# EAGLE board pandaLight (EAGLE 7.6.0)
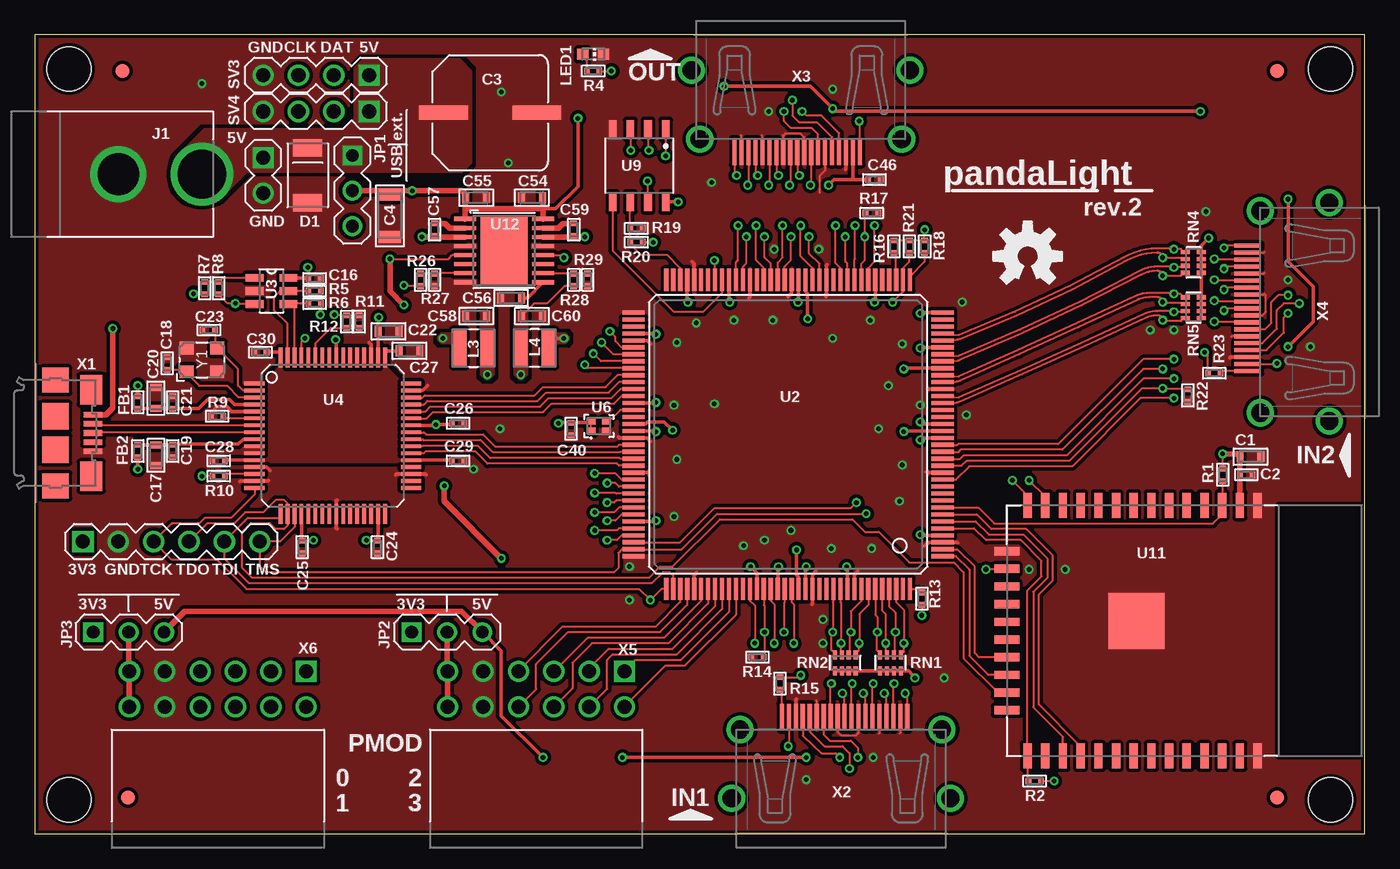
[diagram p9: board, top side]
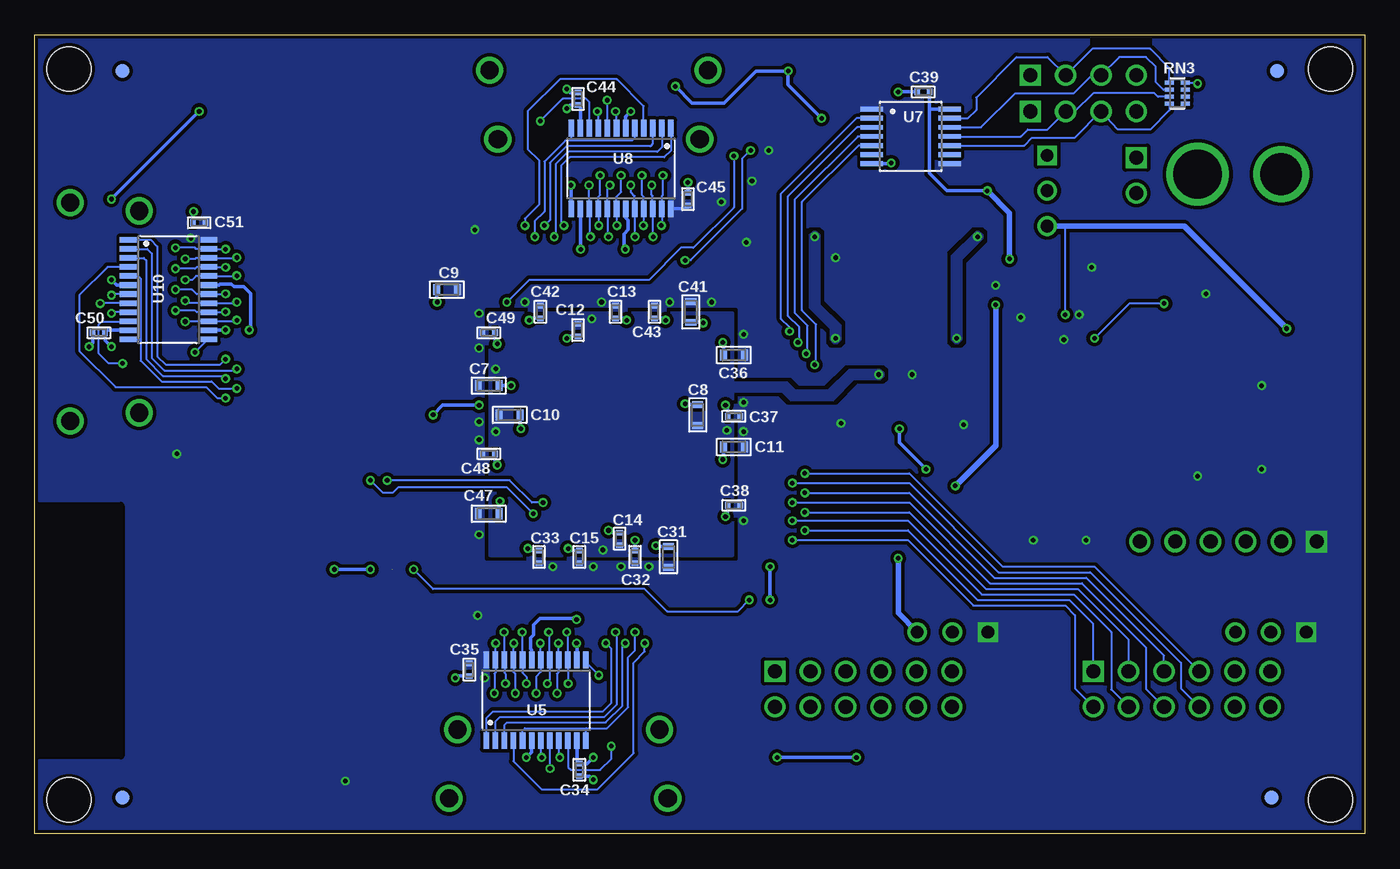
[diagram p10: board, bottom side, seen from below]

Size 95.5 x 57.4 mm. Coordinates in mm from the lower left corner, seen from the top.
Outline: 0,0 95.5,0 95.5,57.4 0,57.4 0,0
Copper layers (1*16): Top 0.035mm / dielectric 1.5mm / Bottom 0.035mm
Design rules "SeeedStudio_2layer_DRU_no_angle_20140221": minimum track width 6mil, minimum drill 12mil, track to track 6mil, track to pad 6mil, pad to pad 6mil, via to via 6mil, smd to smd 0mil, copper to edge 10mil, drill to drill 10mil, minimum pad ring 10mil, minimum via ring 6mil, stop-mask expansion 2mil, vias tented up to drill 100mil, thermal gap 10mil
Net classes: 0 default: width 0.152 mm, clearance 0.152 mm; 1 power: width 0.152 mm, clearance 0.152 mm; 2 tmds: width 0.152 mm, clearance 0.152 mm
Holes 3.17 mm at 2.45,54.95 2.45,2.45 93.05,54.95 93.05,2.45
tRestrict: 1 lines
bRestrict: 1 lines

## Footprints (pad centres in the part's own frame; a part is rotated, then mirrored left to right if it is on the bottom)
C0603 = smd 0.5 x 0.8: 1 -0.75,0; 2 0.75,0
C0402 = smd 0.4 x 0.5: 1 -0.45,0; 2 0.45,0
MVY_HA0 = smd 1 x 3.5: 1 0,3.35; 2 0,-3.35
C1206 = smd 0.85 x 1.6: 1 -1.525,0; 2 1.525,0
DO-214AC = smd 1.27 x 2.1: A 1.98,0; C -1.98,0
FB0402 = smd 0.4 x 0.5: 1 -0.45,0; 2 0.45,0
FIDUCIAL-1X2 = smd 1 x 1: 1 0,0
PJ-037A = drill 3: BARREL 0,0 | drill 3.5: CENTER 6,0
JP2 = drill 0.914 square: 1 -2.54,0 | drill 0.914: 2 0,0; 3 2.54,0
SRN3015_3X3 = smd 2.7 x 1: 1 0,1; 2 0,-1
LED-0603 = smd 0.8 x 0.8: A -0.75,0; C 0.75,0
R0402 = smd 0.4 x 0.5: 1 -0.45,0; 2 0.45,0
741C083 = smd 0.3 x 0.65: 1 -0.75,-0.575; 2 -0.25,-0.575; 3 0.25,-0.575; 4 0.75,-0.575; 5 0.75,0.575; 6 0.25,0.575; 7 -0.25,0.575; 8 -0.75,0.575
MA02-1 = drill 1.016 square: 1 -1.27,0 | drill 1.016: 2 1.27,0
MA06-1 = drill 1.016 square: 1 -6.35,0 | drill 1.016: 2 -3.81,0; 3 -1.27,0; 4 1.27,0; 5 3.81,0; 6 6.35,0
MA04-1 = drill 1.016 square: 1 -3.81,0 | drill 1.016: 2 -1.27,0; 3 1.27,0; 4 3.81,0
TQ144 = smd 1.6 x 0.3: P1 -11.1,8.75; P2 -11.1,8.25; P3 -11.1,7.75; P4 -11.1,7.25; P5 -11.1,6.75; P6 -11.1,6.25; P7 -11.1,5.75; P8 -11.1,5.25; P9 -11.1,4.75; P10 -11.1,4.25; P11 -11.1,3.75; P12 -11.1,3.25; P13 -11.1,2.75; P14 -11.1,2.25; P15 -11.1,1.75; P16 -11.1,1.25; P17 -11.1,0.75; P18 -11.1,0.25; P19 -11.1,-0.25; P20 -11.1,-0.75; P21 -11.1,-1.25; P22 -11.1,-1.75; P23 -11.1,-2.25; P24 -11.1,-2.75; P25 -11.1,-3.25; P26 -11.1,-3.75; P27 -11.1,-4.25; P28 -11.1,-4.75; P29 -11.1,-5.25; P30 -11.1,-5.75; P31 -11.1,-6.25; P32 -11.1,-6.75; P33 -11.1,-7.25; P34 -11.1,-7.75; P35 -11.1,-8.25; P36 -11.1,-8.75; P73 11.1,-8.75; P74 11.1,-8.25; P75 11.1,-7.75; P76 11.1,-7.25; P77 11.1,-6.75; P78 11.1,-6.25; P79 11.1,-5.75; P80 11.1,-5.25; P81 11.1,-4.75; P82 11.1,-4.25; P83 11.1,-3.75; P84 11.1,-3.25; P85 11.1,-2.75; P86 11.1,-2.25; P87 11.1,-1.75; P88 11.1,-1.25; P89 11.1,-0.75; P90 11.1,-0.25; P91 11.1,0.25; P92 11.1,0.75; P93 11.1,1.25; P94 11.1,1.75; P95 11.1,2.25; P96 11.1,2.75; P97 11.1,3.25; P98 11.1,3.75; P99 11.1,4.25; P100 11.1,4.75; P101 11.1,5.25; P102 11.1,5.75; P103 11.1,6.25; P104 11.1,6.75; P105 11.1,7.25; P106 11.1,7.75; P107 11.1,8.25; P108 11.1,8.75 | smd 0.3 x 1.6: P37 -8.75,-11.1; P38 -8.25,-11.1; P39 -7.75,-11.1; P40 -7.25,-11.1; P41 -6.75,-11.1; P42 -6.25,-11.1; P43 -5.75,-11.1; P44 -5.25,-11.1; P45 -4.75,-11.1; P46 -4.25,-11.1; P47 -3.75,-11.1; P48 -3.25,-11.1; P49 -2.75,-11.1; P50 -2.25,-11.1; P51 -1.75,-11.1; P52 -1.25,-11.1; P53 -0.75,-11.1; P54 -0.25,-11.1; P55 0.25,-11.1; P56 0.75,-11.1; P57 1.25,-11.1; P58 1.75,-11.1; P59 2.25,-11.1; P60 2.75,-11.1; P61 3.25,-11.1; P62 3.75,-11.1; P63 4.25,-11.1; P64 4.75,-11.1; P65 5.25,-11.1; P66 5.75,-11.1; P67 6.25,-11.1; P68 6.75,-11.1; P69 7.25,-11.1; P70 7.75,-11.1; P71 8.25,-11.1; P72 8.75,-11.1; P109 8.75,11.1; P110 8.25,11.1; P111 7.75,11.1; P112 7.25,11.1; P113 6.75,11.1; P114 6.25,11.1; P115 5.75,11.1; P116 5.25,11.1; P117 4.75,11.1; P118 4.25,11.1; P119 3.75,11.1; P120 3.25,11.1; P121 2.75,11.1; P122 2.25,11.1; P123 1.75,11.1; P124 1.25,11.1; P125 0.75,11.1; P126 0.25,11.1; P127 -0.25,11.1; P128 -0.75,11.1; P129 -1.25,11.1; P130 -1.75,11.1; P131 -2.25,11.1; P132 -2.75,11.1; P133 -3.25,11.1; P134 -3.75,11.1; P135 -4.25,11.1; P136 -4.75,11.1; P137 -5.25,11.1; P138 -5.75,11.1; P139 -6.25,11.1; P140 -6.75,11.1; P141 -7.25,11.1; P142 -7.75,11.1; P143 -8.25,11.1; P144 -8.75,11.1
SOT23-6 = smd 1.27 x 0.559: 1 -1.219,0.94; 2 -1.219,0; 3 -1.219,-0.94; 4 1.219,-0.94; 5 1.219,0; 6 1.219,0.94
LQFP64 = smd 1.45 x 0.27: 1 -5.625,3.75; 2 -5.625,3.25; 3 -5.625,2.75; 4 -5.625,2.25; 5 -5.625,1.75; 6 -5.625,1.25; 7 -5.625,0.75; 8 -5.625,0.25; 9 -5.625,-0.25; 10 -5.625,-0.75; 11 -5.625,-1.25; 12 -5.625,-1.75; 13 -5.625,-2.25; 14 -5.625,-2.75; 15 -5.625,-3.25; 16 -5.625,-3.75; 33 5.625,-3.75; 34 5.625,-3.25; 35 5.625,-2.75; 36 5.625,-2.25; 37 5.625,-1.75; 38 5.625,-1.25; 39 5.625,-0.75; 40 5.625,-0.25; 41 5.625,0.25; 42 5.625,0.75; 43 5.625,1.25; 44 5.625,1.75; 45 5.625,2.25; 46 5.625,2.75; 47 5.625,3.25; 48 5.625,3.75 | smd 0.27 x 1.45: 17 -3.75,-5.625; 18 -3.25,-5.625; 19 -2.75,-5.625; 20 -2.25,-5.625; 21 -1.75,-5.625; 22 -1.25,-5.625; 23 -0.75,-5.625; 24 -0.25,-5.625; 25 0.25,-5.625; 26 0.75,-5.625; 27 1.25,-5.625; 28 1.75,-5.625; 29 2.25,-5.625; 30 2.75,-5.625; 31 3.25,-5.625; 32 3.75,-5.625; 49 3.75,5.625; 50 3.25,5.625; 51 2.75,5.625; 52 2.25,5.625; 53 1.75,5.625; 54 1.25,5.625; 55 0.75,5.625; 56 0.25,5.625; 57 -0.25,5.625; 58 -0.75,5.625; 59 -1.25,5.625; 60 -1.75,5.625; 61 -2.25,5.625; 62 -2.75,5.625; 63 -3.25,5.625; 64 -3.75,5.625
PW_R-PDSO-G24 = smd 1.2 x 0.4: 1 -2.9,3.575; 2 -2.9,2.925; 3 -2.9,2.275; 4 -2.9,1.625; 5 -2.9,0.975; 6 -2.9,0.325; 7 -2.9,-0.325; 8 -2.9,-0.975; 9 -2.9,-1.625; 10 -2.9,-2.275; 11 -2.9,-2.925; 12 -2.9,-3.575; 13 2.9,-3.575; 14 2.9,-2.925; 15 2.9,-2.275; 16 2.9,-1.625; 17 2.9,-0.975; 18 2.9,-0.325; 19 2.9,0.325; 20 2.9,0.975; 21 2.9,1.625; 22 2.9,2.275; 23 2.9,2.925; 24 2.9,3.575
OSCI-1.6X1.2 = smd 0.6 x 0.5: 1 -0.55,-0.35; 2 0.55,-0.35; 3 0.55,0.35; 4 -0.55,0.35
R-PDSO-G14 = smd 0.35 x 1.6: 1 -1.95,-2.8; 2 -1.3,-2.8; 3 -0.65,-2.8; 4 0,-2.8; 5 0.65,-2.8; 6 1.3,-2.8; 7 1.95,-2.8; 8 1.95,2.8; 9 1.3,2.8; 10 0.65,2.8; 11 0,2.8; 12 -0.65,2.8; 13 -1.3,2.8; 14 -1.95,2.8
SO8N = smd 1.35 x 0.55: 1 -2.6,1.905; 2 -2.6,0.635; 3 -2.6,-0.635; 4 -2.6,-1.905; 5 2.6,-1.905; 6 2.6,-0.635; 7 2.6,0.635; 8 2.6,1.905
ESP-WROOM-32 = smd 1.8 x 0.6: 1 -8.3,8.7; 2 -8.3,7.43; 3 -8.3,6.16; 4 -8.3,4.89; 5 -8.3,3.62; 6 -8.3,2.35; 7 -8.3,1.08; 8 -8.3,-0.19; 9 -8.3,-1.46; 10 -8.3,-2.73; 11 -8.3,-4; 12 -8.3,-5.27; 13 -8.3,-6.54; 14 -8.3,-7.81; 25 9.7,-7.81; 26 9.7,-6.54; 27 9.7,-5.27; 28 9.7,-4; 29 9.7,-2.73; 30 9.7,-1.46; 31 9.7,-0.19; 32 9.7,1.08; 33 9.7,2.35; 34 9.7,3.62; 35 9.7,4.89; 36 9.7,6.16; 37 9.7,7.43; 38 9.7,8.7 | smd 0.6 x 1.8: 15 -5.015,-9.3; 16 -3.745,-9.3; 17 -2.475,-9.3; 18 -1.205,-9.3; 19 0.065,-9.3; 20 1.335,-9.3; 21 2.605,-9.3; 22 3.875,-9.3; 23 5.145,-9.3; 24 6.415,-9.3 | smd 4 x 4: PAD 0,0
R-PDSO-G16 = smd 0.3 x 1.6: 1 -2.275,-2.8; 2 -1.625,-2.8; 3 -0.975,-2.8; 4 -0.325,-2.8; 5 0.325,-2.8; 6 0.975,-2.8; 7 1.625,-2.8; 8 2.275,-2.8; 9 2.275,2.8; 10 1.625,2.8; 11 0.975,2.8; 12 0.325,2.8; 13 -0.325,2.8; 14 -0.975,2.8; 15 -1.625,2.8; 16 -2.275,2.8 | smd 5 x 3.4: ETP 0,0
USB-UB-S = smd 0.4 x 1.35: D+ 0,2.675; D- -0.65,2.675; GND 1.3,2.675; ID 0.65,2.675; VBUS -1.3,2.675 | smd 1.8 x 1.9: SH0 -3.8,0; SH3 3.8,0 | smd 1.9 x 1.9: SH1 -1.2,0; SH2 1.2,0 | smd 2.1 x 1.6: SH4 3.1,2.55; SH5 -3.1,2.55
HDMI_TYPE_A_RECEPTICAL = smd 1.9 x 0.3: 1 -3.9,4.75; 2 -3.9,4.25; 3 -3.9,3.75; 4 -3.9,3.25; 5 -3.9,2.75; 6 -3.9,2.25; 7 -3.9,1.75; 8 -3.9,1.25; 9 -3.9,0.75; 10 -3.9,0.25; 11 -3.9,-0.25; 12 -3.9,-0.75; 13 -3.9,-1.25; 14 -3.9,-1.75; 15 -3.9,-2.25; 16 -3.9,-2.75; 17 -3.9,-3.25; 18 -3.9,-3.75; 19 -3.9,-4.25 | drill 1.3: SHIELD0 -3,7.25; SHIELD1 1.95,7.85; SHIELD2 -3,-7.25; SHIELD3 1.95,-7.85
PMOD-2X6 = drill 1.016 square: 1 6.35,1.27 | drill 1.016: 2 3.81,1.27; 3 1.27,1.27; 4 -1.27,1.27; 5 -3.81,1.27; 6 -6.35,1.27; 7 6.35,-1.27; 8 3.81,-1.27; 9 1.27,-1.27; 10 -1.27,-1.27; 11 -3.81,-1.27; 12 -6.35,-1.27
403-3.2X2.5 = smd 1 x 0.9: 1 -1.1,-0.8; 2 1.1,-0.8; 3 1.1,0.9; 4 -1.1,0.9

## Placement (x,y rotation side)
C1  10u  [C0603]  87.3,27.1 0 top
C2  0.1u  [C0402]  87,25.8 0 top
C3  1000u  [MVY_HA0]  32.7,51.8 90 top
C4  100u  [C1206]  25.5,44.4 270 top
C7  4.7u  [C0603]  62.9,32.2 0 bottom
C8  4.7u  [C0603]  47.9,30.1 90 bottom
C9  4.7u  [C0603]  65.9,39.1 180 bottom
C10  4.7u  [C0603]  61.4,30.1 0 bottom
C11  4.7u  [C0603]  45.3,27.8 180 bottom
C12  0.47u  [C0402]  56.5,36.2 270 bottom
C13  0.47u  [C0402]  53.8,37.5 270 bottom
C14  0.47u  [C0402]  53.5,21.2 90 bottom
C15  0.47u  [C0402]  56.4,19.9 90 bottom
C16  0.1u  [C0402]  20.1,39.9 0 top
C17  4.7u  [C0603]  8.7,27.2 270 top
C18  27p  [C0402]  9.5,33.8 90 top
C19  0.1u  [C0402]  9.9,27.5 270 top
C20  4.7u  [C0603]  8.7,31.3 90 top
C21  0.1u  [C0402]  9.9,31 90 top
C22  4.7u  [C0603]  25.4,36.1 0 top
C23  27p  [C0402]  12.5,36.2 180 top
C24  0.1u  [C0402]  24.6,20.6 270 top
C25  0.1u  [C0402]  19.2,20.6 270 top
C26  0.1u  [C0402]  30.4,29.5 0 top
C27  4.7u  [C0603]  26.9,34.7 0 top
C28  0.1u  [C0402]  13.2,26.8 180 top
C29  0.1u  [C0402]  30.4,26.8 0 top
C30  0.1u  [C0402]  16.2,34.6 180 top
C31  4.7u  [C0603]  50,19.9 90 bottom
C32  0.47u  [C0402]  52.4,19.9 90 bottom
C33  0.47u  [C0402]  59.3,19.9 90 bottom
C34  0.1u  [C0402]  56.4,4.6 270 bottom
C35  0.1u  [C0402]  64.3,11.8 270 bottom
C36  4.7u  [C0603]  45.3,34.4 180 bottom
C37  0.47u  [C0402]  45.3,30 180 bottom
C38  0.47u  [C0402]  45.3,23.6 180 bottom
C39  0.47u  [C0402]  31.7,53.3 180 bottom
C40  0.1u  [C0402]  38.5,29.1 270 top
C41  4.7u  [C0603]  48.4,37.5 270 bottom
C42  0.47u  [C0402]  59.2,37.5 270 bottom
C43  0.47u  [C0402]  51,37.5 270 bottom
C44  0.1u  [C0402]  56.5,52.8 90 bottom
C45  0.1u  [C0402]  48.6,45.6 90 bottom
C46  0.1u  [C0402]  60.3,47 0 top
C47  4.7u  [C0603]  62.9,23 0 bottom
C48  0.47u  [C0402]  62.9,27.3 0 bottom
C49  0.47u  [C0402]  62.9,36 0 bottom
C50  0.1u  [C0402]  90.9,36 180 bottom
C51  0.1u  [C0402]  83.7,43.9 180 bottom
C54  10u  [C0603]  35.7,45.7 180 top
C55  10u  [C0603]  31.7,45.7 0 top
C56  4.7u  [C0603]  34.2,38.5 180 top
C57  0.1u  [C0402]  28.7,43.4 270 top
C58  22u  [C0603]  31.7,37.2 180 top
C59  0.1u  [C0402]  38.7,43.4 270 top
C60  22u  [C0603]  35.7,37.2 0 top
D1  6V  [DO-214AC]  19.6,47.3 270 top
FB1  1A  [FB0402]  7.4,31 270 top
FB2  1A  [FB0402]  7.4,27.5 90 top
FID1  FIDUCIAL1X2  [FIDUCIAL-1X2]  6.3,54.8 0 top
FID2  FIDUCIAL1X2  [FIDUCIAL-1X2]  89.2,54.8 0 top
FID3  FIDUCIAL1X2  [FIDUCIAL-1X2]  6.7,2.6 0 top
FID4  FIDUCIAL1X2  [FIDUCIAL-1X2]  89.2,2.6 0 top
FID5  FIDUCIAL1X2  [FIDUCIAL-1X2]  6.3,54.8 0 bottom
FID6  FIDUCIAL1X2  [FIDUCIAL-1X2]  89.2,54.8 0 bottom
FID7  FIDUCIAL1X2  [FIDUCIAL-1X2]  6.7,2.6 0 bottom
FID8  FIDUCIAL1X2  [FIDUCIAL-1X2]  89.2,2.6 0 bottom
J1  PJ-037A  [PJ-037A]  6,47.4 0 top
JP1  5V_SEL  [JP2]  22.8,46.2 270 top
JP2  PMOD2-3_VCC_SEL  [JP2]  29.6,14.5 0 top
JP3  PMOD0-1_VCC_SEL  [JP2]  6.74,14.5 0 top
L3  2.2u, 1.3A  [SRN3015_3X3]  31.5,34.9 90 top
L4  1.5u, 1.3  [SRN3015_3X3]  35.9,34.9 270 top
LED1  Green  [LED-0603]  40.1,56 0 top
OSHW-LOGO  [OSHW-LOGO-M]  71.3,41.5 0 top
R1  10k  [R0402]  85.3,25.8 90 top
R2  4.7k  [R0402]  71.8,3.8 0 top
R4  1k  [R0402]  40.1,54.8 0 top
R5  10k  [R0402]  20.1,39 0 top
R6  10k  [R0402]  20.1,38.1 0 top
R7  10k  [R0402]  12.2,39.2 270 top
R8  2.2k  [R0402]  13.2,39.2 270 top
R9  12k  [R0402]  13.1,30 0 top
R10  10k  [R0402]  13.2,25.7 0 top
R11  10k  [R0402]  23.3,36.8 90 top
R12  4.7k  [R0402]  22.4,36.8 270 top
R13  1k  [R0402]  63.7,16.9 270 top
R14  10k  [R0402]  51.9,12.7 0 top
R15  1k  [R0402]  53.5,10.8 270 top
R16  4.7k  [R0402]  61.7,42.2 90 top
R17  10k  [R0402]  60.1,44.6 180 top
R18  4.7k  [R0402]  63.9,42.2 90 top
R19  100  [R0402]  43.2,43.5 180 top
R20  100  [R0402]  43.2,42.5 0 top
R21  2.4k  [R0402]  62.8,42.2 90 top
R22  10k  [R0402]  82.8,31.5 90 top
R23  1k  [R0402]  84.7,33.1 0 top
R26  73.2  [R0402]  27.7,39.8 270 top
R27  22.1  [R0402]  28.7,39.8 270 top
R28  12.7  [R0402]  38.7,39.8 270 top
R29  22.1  [R0402]  39.7,39.8 270 top
RN1  51  [741C083]  61.45,12.3 180 top
RN2  51  [741C083]  58.2,12.3 180 top
RN3  100k  [741C083]  13.44,53.2 90 bottom
RN4  51  [741C083]  83.2,41.05 270 top
RN5  51  [741C083]  83.2,37.8 270 top
SV1  EXT_SUP  [MA02-1]  16.4,47.3 270 top
SV2  JTAG  [MA06-1]  9.8,21 0 top
SV3  LEDS_CON  [MA04-1]  20.2,54.5 180 top
SV4  LEDS_CON  [MA04-1]  20.2,51.9 180 top
U2  6SLX9TQG144  [TQ144]  54.1,28.7 180 top
U3  93LC46BT-I/OT  [SOT23-6]  17,39 0 top
U4  FT2232HL  [LQFP64]  21.4,28.6 0 top
U5  TPD12S016PWR  [PW_R-PDSO-G24]  59.5,9.6 90 bottom
U6  20Mhz  [OSCI-1.6X1.2]  40.5,29.3 0 top
U7  TXB0104PWR  [R-PDSO-G14]  32.6,50.1 270 bottom
U8  TPD12S016PWR  [PW_R-PDSO-G24]  53.4,47.8 270 bottom
U9  M25P40-VMN  [SO8N]  43.4,48 270 top
U10  TPD12S016PWR  [PW_R-PDSO-G24]  85.9,39.1 0 bottom
U11  ESP-WROOM-32  [ESP-WROOM-32]  79.1,15.3 270 top
U12  TPS542941PWP  [R-PDSO-G16]  33.7,41.9 270 top
X1  USBUB-S  [USB-UB-S]  1.5,28.8 270 top
X2  HDMI_RECEPTICAL_A  [HDMI_TYPE_A_RECEPTICAL]  57.9,4.5 270 top
X3  HDMI_RECEPTICAL_A  [HDMI_TYPE_A_RECEPTICAL]  55,52.9 90 top
X4  HDMI_RECEPTICAL_A  [HDMI_TYPE_A_RECEPTICAL]  91,37.5 0 top
X5  PMOD-2X6  [PMOD-2X6]  36,10.4 0 top
X6  PMOD-2X6  [PMOD-2X6]  13.14,10.4 0 top
Y1  403  [403-3.2X2.5]  12,34 0 top

## Tracks (layer width: path | path; a pad name or v marks a point on that pad's centre or on a via)
5V_SUP
  pour Top (isolate 0.254, no thermals): 31.3,54.8 31.3,48.2 30.7,47.6 15.2,47.6 13.6,46 arc-180 10.4,48.8 12.2,50.6 22.3,50.6 23,51.3 23,55 23.6,55.6 30.5,55.6
+1V2  (via drill 0.33)
  Top 0.152: R28.2 38.05,39.35 36.8,38.1 35.85,38.1 C60.1
  Top 0.254: U2.P28 62.45,33.45 v62.4,33.4 | U2.P19 62.45,28.95 v62.4,28.9 | U2.P52 55.35,38.95 55.5,38.8 v55.5,37 | U2.P128 54.85,18.45 54.7,18.6 v54.7,20.4 | U2.P89 43.85,29.45 44,29.6 45.2,29.6 v45.8,29
  other vias: 34.9,33
  pour Bottom (isolate 0.254, no thermals): 45.4,37.4 62.8,37.4 62.8,20 45.4,20 45.4,31.8 41.8,31.8 41.2,31.2 38.2,31.2 36.7,32.7 34.8,32.7 34.6,32.9 34.6,33.1 34.8,33.3 37,33.3 38.5,31.8 40.9,31.8 41.5,32.4 45.4,32.4
  pour Top (isolate 0.254, no thermals): 35.3,37.5 35.3,33 35,32.7 34.8,32.7 34.5,33 34.5,37.5
+1V8
  Top 0.254: U4.37 29.9,26.85 C29.1 | U4.12 13.7,26.85 C28.1 | U4.64 17.65,34.6 C30.1 | U4.49 25.15,34.65 25.2,34.7 C27.1
  pour Top (isolate 0.254, no thermals): 16.5,32.5 16.5,26.7 26.3,26.7 26.3,32.5 25.3,33.5 17.5,33.5
+3V3  (via drill 0.33)
  Top 0.152: R13.2 v63.7,15.7 | U9.3 42.77,49.13 v42.8,49.1 | R20.2 v44.4,42.5 | v63.9,43.4 R18.2 R21.2 R16.2 | U6.1 U6.4 | R7.2 11.45,38.75 v11.4,38.8 | R10.1 v12,25.7 | v44,46.9 44.03,46.87 U9.7 | R6.2 R5.2 20.55,37.35 v20.5,37.3 | R26.2 26.55,39.35 v26.5,39.4 | U12.12 37.83,41.58 v38,41.4 | R1.2 v85.3,27.3 | R2.2 v73.2,3.8
  Top 0.254: U2.P53 54.83,38.23 v54.8,38.2 | U4.56 21.65,35.45 v21.6,35.5 | U4.42 28.75,29.35 v28.8,29.4 29.85,29.4 C26.1 | U2.P76 44.55,35.95 v44.6,35.9 | U2.P42 60.35,38.25 v60.3,38.2 | U2.P36 63.65,37.45 v63.6,37.4 | U2.P4 63.65,21.45 v63.6,21.5 | U2.P135 58.35,19.15 v58.3,19.2 | U2.P125 53.35,19.15 v53.4,19.2 | U2.P122 51.85,18.75 v51.4,19.2 | U2.P31 63.65,34.95 v63.6,34.9 | U9.8 v46.2,45.4 | U2.P20 63.75,29.45 v63.6,29.6 | U2.P18 63.75,28.45 v63.6,28.3 | U2.P86 44.55,30.95 v44.6,31 | U2.P90 44.55,28.95 v44.6,28.9 | U2.P103 44.55,22.45 v44.6,22.5 | U2.P129 55.35,19.15 v55.4,19.2 | U2.P63 49.85,38.25 v49.9,38.2 | U2.P69 46.85,38.25 v46.9,38.2 | RN2.5 RN2.6 RN2.7 RN2.8 RN1.5 RN1.6 RN1.7 RN1.8 62.77,11.72 v63.2,11.2 | RN5.5 RN5.6 RN5.7 RN5.8 RN4.5 RN4.6 RN4.7 RN4.8 83.78,42.27 v84.3,42.8 | FB2.1 v7.4,26.2 | FB1.1 v7.4,32.2 | U4.20 19.15,21.1 C25.1 19.95,21.05 v20,21.1 | U4.31 24.65,21.1 C24.1 23.85,21.05 v23.8,21.1 | v37.6,29.5 37.65,29.55 C40.1 39.85,29.55 U6.4 | U4.50 C22.1 24.65,37.05 v24.7,37.1 | U3.6 19.61,39.94 C16.1 19.65,40.65 v19.6,40.7
  Top 0.406: v85.3,27.3 86.35,27.3 C1.1 C2.1 86.53,25.78 U11.2
  Bottom 0.254: U8.24 48.65,44.9 C45.1
  other vias: 32.5,33
  pour Bottom (isolate 0.254, rank 6, no thermals): 0,57.4 95.5,57.4 95.5,0 0,0
  pour Top (isolate 0.254, no thermals): 32.1,37.5 32.9,37.5 32.9,33 32.6,32.7 32.4,32.7 32.1,33
+5V  (via drill 0.33)
  Top 0.152: v25.5,41.3 29.7,41.3 29.98,41.58 U12.5 | R4.2 v41.4,54.8
  Top 0.254: v49.5,53.7 55.7,53.7 v57.3,52.1 57.5,51.9 v83.7,51.9 | v55.4,5.5 v42.2,5.5 | v36.5,5.5 33.5,8.5 33.5,13.14 JP2.3 | v90,45.6 90,41.1 91.8,39.3 91.8,36.8 v90,35 | 36.5,44.9 37.4,44.9 39,46.5 v39,51.4
  Top 0.406: v29.4,25 29.4,23.9 v33.5,19.8 | JP3.3 10.78,16 30.64,16 JP2.3 | JP1.2 25.3,46.2 | 25.3,46.2 v27.1,46.2 30.7,46.2 30.95,45.95 C55.1 30.9,45.65 30.9,44.9 | 36.5,44.9 30.9,44.9 | U12.1 30.9,44.9 | U12.16 36.5,44.9 | 36.5,44.9 36.5,45.65 C54.1 | C4.1 25.3,46.2 | v26.5,38 25.5,39 v25.5,41.3
  Bottom 0.254: U8.11 56.33,52.17 C44.1 57.05,52.35 v57.3,52.1 | v55.4,5.5 55.85,5.05 C34.1 56.58,5.22 U5.11 | v42.2,5.5 v36.5,5.5 | U10.11 90.28,36.17 C50.1 90.45,35.45 v90,35 | v49.5,53.7 48.3,52.5 46,52.5 43.7,54.8 v41.4,54.8 41.4,53.8 v39,51.4 | U7.14 31.25,52.05 | 31.25,52.05 C39.1 | 31.25,52.05 31.25,47.45 30,46.2 v27.1,46.2 | v90,45.6 v83.7,51.9
  Bottom 0.406: v25.5,41.3 25.5,44.6 v27.1,46.2 | v26.5,38 26.5,27.9 v29.4,25 | v33.5,19.8 33.5,15.86 JP2.3
ESP_CTS
  Top 0.152: U2.P1 66.15,19.95 67.1,19 67.1,12.8 68.47,11.43 U11.22
ESP_EN
  Top 0.152: R1.1 85.26,25.31 U11.3 85.26,22.96 84.6,22.3 68.9,22.3 67.75,23.45 U2.P8
ESP_IO0
  Top 0.152: R2.1 71.29,3.86 U11.25 71.29,17.49 72.3,18.5 72.3,19.6 70.8,21.1 68.3,21.1 67.45,21.95 U2.P5
ESP_RTS
  Top 0.152: U2.P2 66.25,20.45 67.5,19.2 67.5,13 67.81,12.7 U11.21
ESP_RX
  Top 0.152: U2.P6 67.55,22.45 68.5,21.5 71,21.5 72.7,19.8 72.7,18.4 71.7,17.4 71.7,9.1 73.83,6.97 U11.27
ESP_TDO
  Top 0.152: SV2.4 12.37,22.3 14.3,22.3 15.1,23.1 16.4,23.1 17.3,24 17.9,24 18.15,23.75 U4.18 18.15,22.15 17.9,21.9 17.3,21.9 16.9,22.3 15.5,22.3 14.9,21.7 14.9,19.1 15.6,18.4 44.1,18.4 44.9,19.2 45.8,19.2 49.2,22.6 58.7,22.6 59.6,21.7 60.6,21.7 62.8,19.5 66,19.5 66.7,18.8 66.7,12.6 69.14,10.15 U11.23
ESP_TX
  Top 0.152: U11.28 75.1,6.3 72.1,9.3 72.1,17.2 73.1,18.2 73.1,20 71.2,21.9 68.7,21.9 67.65,22.95 U2.P7
FPGA_CLK20
  Top 0.152: U2.P87 42.05,30.45 41.25,29.65 U6.3
FPGA_TDO  (via drill 0.33)
  Top 0.152: U2.P106 46.35,20.95 48.8,23.4 58.6,23.4 v59,23.8 | U11.14 71.29,24.31 v70.2,25.4
  Bottom 0.152: v59,23.8 59.8,23.8 61.4,25.4 v70.2,25.4
GND  (via drill 0.33)
  Top 0.152: X2.2 62.15,7.25 62.1,7.2 | X2.5 60.65,7.25 60.6,7.2 | X2.8 59.15,7.25 59,7.1 57.9,7.1 57.65,7.35 X2.11 | X2.14 56.15,9.55 56.1,9.6 | X4.2 88.25,41.75 88.3,41.8 | X4.5 88.25,40.25 88.3,40.3 | X4.8 88.25,38.75 88.3,38.8 88.4,38.7 88.4,37.5 88.15,37.25 X4.11 | X4.14 85.95,35.75 85.9,35.7 | X3.2 50.75,50.15 50.7,50.2 | X3.5 52.25,50.15 52.2,50.2 | X3.8 53.75,50.15 | 53.75,50.15 53.7,50.2 | X3.11 55.25,50.05 55,50.3 53.9,50.3 53.75,50.15 | X3.14 56.75,47.65 56.35,47.25 56.35,46.05
  Top 0.254: U4.51 24.15,35.15 24,35.3 | U4.47 27.85,31.85 28.2,32.2 | U2.P68 47.35,40.95 47.2,41.1 | U2.P60 51.35,38.55 51.3,38.5 | 56.8,38.6 56.85,38.65 U2.P49 56.85,40.85 56.9,40.9 | U2.P25 64.15,31.95 64.1,32 | 56.1,18.9 55.85,18.65 U2.P130 55.85,16.55 55.8,16.5 | U2.P136 58.85,18.65 59.1,18.9 | 66.3,20.9 66.25,20.95 U2.P3 64.15,20.95 63.9,20.7 | U2.P13 64.05,25.95 64,26 | U2.P113 47.35,18.65 47.5,18.8 | X2.17 54.65,9.65 54.7,9.7 | X4.17 85.85,34.25 85.8,34.2 | X3.17 58.25,47.75 58.2,47.7 | 21.7,24 21.65,23.95 U4.25 21.65,21.95 21.7,21.9 | 25.9,25.8 25.95,25.85 U4.35 28.05,25.85 28.1,25.8 | 41.9,28.5 41.95,28.45 U2.P91 43.95,28.45 44.2,28.2 | 16.8,25.4 16.75,25.35 U4.15 14.75,25.35 14.7,25.3 | U4.13 16.65,26.35 16.9,26.1 | U4.5 14.15,30.35 13.8,30.7 13.1,30.7 12.65,30.25 R9.1 | U2.P54 54.35,38.85 54.1,38.6 | U2.P96 44.05,25.95 44.1,26 | U2.P77 43.95,35.45 44.2,35.2
  Bottom 0.152: RN3.1 RN3.2 RN3.3 RN3.4 12.05,53.95 v12,53.9
  Bottom 0.254: U8.14 56.33,43.73 v56.3,42 | U8.6 53.08,51.52 v52.7,51.9 | U5.14 56.58,13.68 v56.6,13.7 | U5.6 59.83,5.88 v60.2,5.5 | v42.7,19.2 v42.7,16.8 | C7.2 v61.3,32.2 | C32.2 v52.4,21.1 | U5.19 59.83,13.22 59.9,13.3 59.9,14.1 59.7,14.3 59.7,15 59.2,15.5 56.7,15.5 v56.6,15.4 | U8.19 53.08,44.27 52.9,44.1 52.9,43.4 53.2,43.1 53.2,42.1 v53.1,42 | U10.14 81.83,36.17 v81.8,36.2 | U10.19 82.28,39.42 82.2,39.5 81.4,39.5 81.2,39.3 80.5,39.3 80,38.8 80,36.3 v80.1,36.2 | U10.6 89.62,39.42 v90,39.8 | 91.55,35.05 v91.6,35 91.35,35.25 C50.2 | 55.45,3.95 v55.4,3.9 55.65,4.15 C34.2 | C45.2 v48.6,46.8 | C44.2 57.05,53.25 v57.3,53.5 | C9.2 66.65,38.25 v66.6,38.2 | C51.2 84.15,44.65 v84.1,44.7 | C35.2 65.15,11.35 v65.3,11.2 | C33.2 59.95,20.35 v60.1,20.5 | C47.2 62.15,23.85 v62.1,23.9 | C48.2 62.45,26.65 v62.3,26.5 | C10.2 60.65,29.15 v60.6,29.1 | C15.2 57.05,20.35 v57.2,20.5 | C49.2 62.45,35.35 v62.3,35.2 | C42.2 59.85,37.05 v60,36.9 | C12.2 57.15,35.75 v57.3,35.6 | C14.2 54.15,21.65 v54.3,21.8 | C31.2 50.95,20.65 v50.9,20.7 | C38.2 45.75,22.95 v45.9,22.8 | C11.2 46.05,26.95 v46.1,26.9 | C37.2 45.75,30.65 v45.9,30.8 | C8.2 48.75,30.85 v48.8,30.9 | C36.2 46.05,35.25 v46.1,35.3 | C41.2 47.55,36.75 v47.5,36.7 | C43.2 50.35,37.05 v50.2,36.9 | C13.2 53.15,37.05 v53,36.9 | C39.2 v33.5,53.3 | U7.7 34.05,48.15 v34,48.2 | v33.4,29.1 33.4,28.1 v31.5,26.2 | v63.6,30.8 66.2,30.8 v66.9,30.1 | v71.4,19 v74,19
  pour Top (isolate 0.254, rank 6, no thermals): 0,57.4 95.5,57.4 95.5,0 0,0
HDMI_RX0_CEC  (via drill 0.33)
  Top 0.152: v59.1,5.5 59.1,6.2 58.6,6.7 57.1,6.7 56.65,7.15 X2.13
  Bottom 0.152: U5.7 59.17,5.58 v59.1,5.5
HDMI_RX0_CEC_3V3  (via drill 0.33)
  Top 0.152: U2.P127 54.35,16.65 54.5,16.5 v54.5,13.7
  Bottom 0.152: U5.1 63.08,8.32 62.6,8.8 54.7,8.8 54.1,9.4 54.1,13.3 v54.5,13.7
HDMI_RX0_CLK_N  (via drill 0.33)
  Top 0.152: RN2.4 57.45,12.97 57.23,13.2 57.23,14.43 v57.3,14.5 57.3,16.7 57.35,16.75 U2.P133 | X2.12 57.15,10.75 v57.2,10.8
  Bottom 0.152: v57.2,10.8 57.2,11.7 57.23,11.72 U5.15 57.23,14.43 v57.3,14.5
HDMI_RX0_CLK_P  (via drill 0.33)
  Top 0.152: 58.1,10 v58,10.1 58.15,9.95 X2.10 | RN2.3 57.95,13.03 57.88,13.1 57.88,13.68 v57.9,13.7 57.9,16.6 57.85,16.65 U2.P134
  Bottom 0.152: v58,10.1 58,11.5 57.88,11.62 U5.16 57.88,13.68 v57.9,13.7
HDMI_RX0_DATA0_N  (via drill 0.33)
  Top 0.152: RN2.2 58.45,12.93 58.52,13 58.52,14.43 v58.6,14.5 58.6,16 59.35,16.75 U2.P137 | X2.9 58.65,10.75 v58.7,10.8
  Bottom 0.152: v58.7,10.8 58.52,10.97 U5.17 58.52,14.43 v58.6,14.5
HDMI_RX0_DATA0_P  (via drill 0.33)
  Top 0.152: 59.6,10 v59.5,10.1 59.65,9.95 X2.7 | RN2.1 58.95,12.97 59.17,13.2 59.17,13.68 v59.2,13.7 59.2,15.8 59.85,16.45 U2.P138
  Bottom 0.152: v59.5,10.1 59.5,11.3 59.17,11.62 U5.18 59.17,13.68 v59.2,13.7
HDMI_RX0_DATA1_N  (via drill 0.33)
  Top 0.152: RN1.4 60.7,12.97 60.48,13.2 60.48,14.47 v60.5,14.5 60.5,15.6 60.35,15.75 U2.P139 | X2.6 60.15,10.75 v60.2,10.8
  Bottom 0.152: v60.2,10.8 60.2,11.3 60.48,11.57 U5.20 60.48,14.47 v60.5,14.5
HDMI_RX0_DATA1_P  (via drill 0.33)
  Top 0.152: 61.1,10 v61,10.1 61.15,9.95 X2.4 | RN1.3 61.2,13.12 61.12,13.2 61.12,13.68 v61.1,13.7 61.1,15.8 60.85,16.05 U2.P140
  Bottom 0.152: v61,10.1 61,11.5 61.12,11.62 U5.21 61.12,13.68 v61.1,13.7
HDMI_RX0_DATA2_N  (via drill 0.33)
  Top 0.152: RN1.2 61.7,13.12 61.77,13.2 61.77,14.47 v61.8,14.5 61.8,15.9 61.35,16.35 U2.P141 | X2.3 61.65,10.75 v61.7,10.8
  Bottom 0.152: v61.7,10.8 61.7,11.5 61.77,11.57 U5.22 61.77,14.47 v61.8,14.5
HDMI_RX0_DATA2_P  (via drill 0.33)
  Top 0.152: 62.6,10 v62.5,10.1 62.65,9.95 X2.1 | RN1.1 62.42,13.1 62.42,13.68 v62.4,13.7 62.4,16.1 61.85,16.65 U2.P142
  Bottom 0.152: v62.5,10.1 62.5,11.5 62.42,11.57 U5.23 62.42,13.68 v62.4,13.7
HDMI_RX0_EN  (via drill 0.33)
  Top 0.152: U2.P123 52.35,16.45 52.4,16.4 v52.4,14.5 52.4,12.75 R14.2
  Bottom 0.152: U5.5 60.48,7.42 60.3,7.6 55.9,7.6 | 55.9,7.6 54.4,7.6 52.9,9.1 52.9,12.7 52.4,13.2 v52.4,14.5 | U5.12 55.92,7.58 55.9,7.6
HDMI_RX0_HPD  (via drill 0.33)
  Top 0.152: X2.18 54.15,6.35 v54.1,6.3
  Bottom 0.152: v54.1,6.3 54.1,5.4 54.9,4.6 57,4.6 57.2,4.8 57.2,6.67 U5.10
HDMI_RX0_HPD_3V3  (via drill 0.33)
  Top 0.152: U2.P121 51.35,16.75 51.7,16.4 v51.7,13.7
  Bottom 0.152: U5.4 61.12,5.22 59.1,3.2 55.1,3.2 52.5,5.8 52.5,12.3 51.7,13.1 v51.7,13.7
HDMI_RX0_SCL  (via drill 0.33)
  Top 0.152: v58.5,4.7 58.5,5.8 58,6.3 56.7,6.3 55.65,7.35 X2.15
  Bottom 0.152: U5.8 58.52,4.72 v58.5,4.7
HDMI_RX0_SCL_3V3  (via drill 0.33)
  Top 0.152: U2.P126 53.85,16.65 53.8,16.6 v53.8,14.5
  Bottom 0.152: U5.2 62.42,8.07 62.1,8.4 54.6,8.4 53.7,9.3 53.7,14.4 v53.8,14.5
HDMI_RX0_SDA  (via drill 0.33)
  Top 0.152: v57.8,5.5 57.5,5.8 56.5,5.8 55.2,7 55.15,7.05 X2.16
  Bottom 0.152: U5.9 57.88,5.58 v57.8,5.5
HDMI_RX0_SDA_3V3  (via drill 0.33)
  Top 0.152: U2.P124 52.85,16.75 53.1,16.5 v53.1,13.7
  Bottom 0.152: U5.3 61.77,7.83 61.6,8 54.5,8 53.3,9.2 53.3,13.5 v53.1,13.7
HDMI_RX1_5V  (via drill 0.33)
  Top 0.152: 84.05,34.55 v84,34.6 84.25,34.35 R23.1
  Bottom 0.152: U10.13 83.08,35.52 v84,34.6
HDMI_RX1_CEC  (via drill 0.33)
  Top 0.152: v90,38.7 89.3,38.7 88.8,38.2 88.8,36.7 88.35,36.25 X4.13
  Bottom 0.152: U10.7 89.92,38.77 v90,38.7
HDMI_RX1_CEC_3V3  (via drill 0.33)
  Top 0.152: v81.8,34.1 79.6,34.1 73.5,28 66.3,28 66.25,27.95 U2.P17
  Bottom 0.152: U10.1 87.17,42.67 86.7,42.2 86.7,34.3 86.1,33.7 82.2,33.7 v81.8,34.1
HDMI_RX1_CLK_N  (via drill 0.33)
  Top 0.152: RN5.4 82.53,37.05 82.3,36.83 81.08,36.83 v81,36.9 arc90 80.65,37.25 80.6,37.25 arc25 79.77,37.06 arc-2 66.46,31.06 arc-21 66.2,31 U2.P23 | X4.12 84.75,36.75 v84.7,36.8
  Bottom 0.152: v84.7,36.8 83.7,36.8 83.67,36.83 U10.15 81.08,36.83 v81,36.9
HDMI_RX1_CLK_P  (via drill 0.33)
  Top 0.152: 85.5,37.7 v85.4,37.6 85.55,37.75 X4.10 | RN5.3 82.47,37.55 82.4,37.48 81.83,37.48 | 81.83,37.48 v81.8,37.5 | 81.83,37.48 arc90 81.75,37.55 80.6,37.55 arc25 79.64,37.34 arc-2 66.34,31.34 U2.P24
  Bottom 0.152: v85.4,37.6 84,37.6 83.88,37.48 U10.16 81.83,37.48 v81.8,37.5
HDMI_RX1_DATA0_N  (via drill 0.33)
  Top 0.152: RN5.2 82.47,38.05 82.4,38.12 81.08,38.12 v81,38.2 arc90 80.65,38.55 80,38.55 arc25 79.17,38.36 arc-1 66.46,32.56 arc-22 66.2,32.5 U2.P26 | X4.9 84.75,38.25 v84.7,38.3
  Bottom 0.152: v84.7,38.3 84.53,38.12 U10.17 81.08,38.12 v81,38.2
HDMI_RX1_DATA0_P  (via drill 0.33)
  Top 0.152: 85.5,39.2 v85.4,39.1 85.55,39.25 X4.7 | RN5.1 82.53,38.55 82.3,38.77 81.83,38.77 v81.8,38.8 arc90 81.75,38.85 80,38.85 arc25 79.03,38.64 arc-1 66.34,32.84 U2.P27
  Bottom 0.152: v85.4,39.1 84.2,39.1 83.88,38.77 U10.18 81.83,38.77 v81.8,38.8
HDMI_RX1_DATA1_N  (via drill 0.33)
  Top 0.152: RN4.4 82.53,40.3 82.3,40.08 81.03,40.08 v81,40.1 arc90 80.65,40.45 80.6,40.45 arc28 79.47,40.17 arc-6 66.46,34.06 arc-3 66.3,34 U2.P29 | X4.6 84.75,39.75 v84.7,39.8
  Bottom 0.152: v84.7,39.8 84.2,39.8 83.92,40.08 U10.20 81.03,40.08 v81,40.1
HDMI_RX1_DATA1_P  (via drill 0.33)
  Top 0.152: 85.5,40.7 v85.4,40.6 85.55,40.75 X4.4 | RN4.3 82.47,40.8 82.4,40.73 81.83,40.73 v81.8,40.7 arc90 81.75,40.75 80.6,40.75 arc28 79.33,40.43 arc-6 66.34,34.34 U2.P30
  Bottom 0.152: v85.4,40.6 84,40.6 83.88,40.73 U10.21 81.83,40.73 v81.8,40.7
HDMI_RX1_DATA2_N  (via drill 0.33)
  Top 0.152: RN4.2 82.47,41.3 82.4,41.38 81.03,41.38 v81,41.4 arc90 80.65,41.75 80.6,41.75 arc29 78.37,41.17 arc-8 66.45,35.56 arc-17 66.2,35.5 U2.P32 | X4.3 84.75,41.25 v84.7,41.3
  Bottom 0.152: v84.7,41.3 84,41.3 83.92,41.38 U10.22 81.03,41.38 v81,41.4
HDMI_RX1_DATA2_P  (via drill 0.33)
  Top 0.152: 85.5,42.2 v85.4,42.1 85.55,42.25 X4.1 | RN4.1 82.53,41.8 82.3,42.02 81.83,42.02 v81.8,42 arc90 81.75,42.05 80.6,42.05 arc29 78.23,41.43 arc-8 66.34,35.84 U2.P33
  Bottom 0.152: v85.4,42.1 84,42.1 83.92,42.02 U10.23 81.83,42.02 v81.8,42
HDMI_RX1_EN  (via drill 0.33)
  Top 0.152: R22.2 82.75,32 v81,32 79.5,32 74.3,26.8 66.9,26.8 66.55,26.45 U2.P14
  Bottom 0.152: U10.5 88.08,40.08 87.9,39.9 87.9,35.5 | 87.9,35.5 87.9,34 86.4,32.5 82.8,32.5 82.3,32 v81,32 | U10.12 87.92,35.52 87.9,35.5
HDMI_RX1_HPD  (via drill 0.33)
  Top 0.152: X4.18 89.15,33.75 v89.2,33.8
  Bottom 0.152: v89.2,33.8 90.2,33.8 90.9,34.5 90.9,36.6 90.7,36.8 88.83,36.8 U10.10
HDMI_RX1_HPD_3V3  (via drill 0.33)
  Top 0.152: v81.8,31.3 79.4,31.3 74.5,26.4 67.1,26.4 66.15,25.45 U2.P12
  Bottom 0.152: U10.4 90.28,40.73 92.3,38.7 92.3,34.7 89.7,32.1 83.2,32.1 82.4,31.3 v81.8,31.3
HDMI_RX1_SCL  (via drill 0.33)
  Top 0.152: v90.8,38.1 89.67,38.1 89.2,37.62 89.2,36.3 88.15,35.25 X4.15
  Bottom 0.152: U10.8 90.78,38.12 v90.8,38.1
HDMI_RX1_SCL_3V3  (via drill 0.33)
  Top 0.152: v81,33.4 79.6,33.4 73.8,27.6 66.5,27.6 66.35,27.45 U2.P16
  Bottom 0.152: U10.2 87.42,42.02 87.1,41.7 87.1,34.2 86.2,33.3 81.1,33.3 v81,33.4
HDMI_RX1_SDA  (via drill 0.33)
  Top 0.152: v90,37.4 89.7,37.1 89.7,36 88.45,34.75 X4.16
  Bottom 0.152: U10.9 89.92,37.48 v90,37.4
HDMI_RX1_SDA_3V3  (via drill 0.33)
  Top 0.152: v81.8,32.7 79.6,32.7 74.1,27.2 66.7,27.2 66.45,26.95 U2.P15
  Bottom 0.152: U10.3 87.67,41.38 87.5,41.2 87.5,34.1 86.3,32.9 82,32.9 v81.8,32.7
HDMI_RX_5V  (via drill 0.33)
  Top 0.152: R15.1 54.85,11.25 v55,11.4
  Bottom 0.152: U5.13 55.92,12.32 v55,11.4
HDMI_TX_5V  (via drill 0.33)
  Top 0.254: C46.1 58.8,47 | 58.8,47 57.4,47 v57,46.6 | X3.18 58.75,47.05 58.8,47
  Bottom 0.254: v57,46.6 57,44.92 U8.13
HDMI_TX_CEC  (via drill 0.33)
  Top 0.152: v53.8,51.9 53.8,51.2 54.3,50.7 55.8,50.7 56.25,50.25 X3.13
  Bottom 0.152: U8.7 53.73,51.83 v53.8,51.9
HDMI_TX_CEC_3V3  (via drill 0.33)
  Top 0.152: v57.5,43.7 57.5,41 57.85,40.65 U2.P47
  Bottom 0.152: U8.1 49.83,49.08 50.3,48.6 57.1,48.6 57.7,48 57.7,43.9 v57.5,43.7
HDMI_TX_CLK_N  (via drill 0.33)
  Top 0.152: v55.6,42.9 55.6,41.7 56.35,40.95 U2.P50 | X3.12 55.75,46.65 v55.7,46.6
  Bottom 0.152: v55.6,42.9 55.67,42.98 U8.15 55.67,45.67 55.7,45.7 v55.7,46.6
HDMI_TX_CLK_P  (via drill 0.33)
  Top 0.152: 54.8,47.4 v54.9,47.3 54.75,47.45 X3.10 | v55,43.7 55,41.5 55.85,40.65 U2.P51
  Bottom 0.152: v54.9,47.3 54.9,45.9 55.02,45.77 U8.16 55.02,43.73 v55,43.7
HDMI_TX_CTRL_EN  (via drill 0.33)
  Top 0.152: U2.P44 59.35,40.95 59.6,41.2 v59.6,42.9 59.6,44.55 R17.2
  Bottom 0.152: U8.12 56.98,49.8 | U8.5 52.42,49.98 52.6,49.8 56.98,49.8 | 56.98,49.8 57.4,49.8 58.9,48.3 58.9,44.7 59.6,44 v59.6,42.9
HDMI_TX_DATA0_N  (via drill 0.33)
  Top 0.152: v54.3,42.9 54.3,41.2 53.85,40.75 U2.P55 | X3.9 54.25,46.65 v54.2,46.6
  Bottom 0.152: v54.2,46.6 54.38,46.42 U8.17 54.38,42.98 v54.3,42.9
HDMI_TX_DATA0_P  (via drill 0.33)
  Top 0.152: 53.3,47.4 v53.4,47.3 53.25,47.45 X3.7 | v53.7,43.7 53.7,41.4 53.35,41.05 U2.P56
  Bottom 0.152: v53.4,47.3 53.4,46.1 53.73,45.77 U8.18 53.73,43.73 v53.7,43.7
HDMI_TX_DATA1_N  (via drill 0.33)
  Top 0.152: v52.4,42.9 52.4,41.4 52.85,40.95 U2.P57 | X3.6 52.75,46.65 v52.7,46.6
  Bottom 0.152: v52.7,46.6 52.7,46.1 52.42,45.83 U8.20 52.42,42.92 v52.4,42.9
HDMI_TX_DATA1_P  (via drill 0.33)
  Top 0.152: 51.8,47.4 v51.9,47.3 51.75,47.45 X3.4 | v51.8,43.7 51.8,41.2 52.35,40.65 U2.P58
  Bottom 0.152: v51.9,47.3 51.9,45.9 51.77,45.77 U8.21 51.77,43.73 v51.8,43.7
HDMI_TX_DATA2_N  (via drill 0.33)
  Top 0.152: v51.1,42.9 51.1,41 50.85,40.75 U2.P61 | X3.3 51.25,46.65 v51.2,46.6
  Bottom 0.152: v51.2,46.6 51.2,45.9 51.12,45.83 U8.22 51.12,42.92 v51.1,42.9
HDMI_TX_DATA2_P  (via drill 0.33)
  Top 0.152: 50.3,47.4 v50.4,47.3 50.25,47.45 X3.1 | v50.5,43.7 50.5,41.2 50.35,41.05 U2.P62
  Bottom 0.152: v50.4,47.3 50.4,45.9 50.48,45.83 U8.23 50.48,43.73 v50.5,43.7
HDMI_TX_HPD  (via drill 0.33)
  Top 0.152: X3.19 59.25,51.15 v59.2,51.2
  Bottom 0.152: U8.10 55.67,52.58 55.9,52.8 57.6,52.8 v59.2,51.2
HDMI_TX_HPD_3V3  (via drill 0.33)
  Top 0.152: U2.P43 59.85,40.65 60.3,41.1 v60.3,43.7
  Bottom 0.152: U8.4 51.77,52.27 53.7,54.2 57.8,54.2 60.1,51.9 60.1,49.2 59.3,48.4 59.3,45.2 60.3,44.2 v60.3,43.7
HDMI_TX_SCL  (via drill 0.33)
  Top 0.152: v54.4,52.7 54.4,51.6 54.9,51.1 56.2,51.1 57.25,50.05 X3.15
  Bottom 0.152: U8.8 54.38,52.67 v54.4,52.7
HDMI_TX_SCL_3V3  (via drill 0.33)
  Top 0.152: v58.2,42.9 58.2,41.1 58.35,40.95 U2.P46
  Bottom 0.152: U8.2 50.48,49.33 50.8,49 57.2,49 58.1,48.1 58.1,43 v58.2,42.9
HDMI_TX_SDA  (via drill 0.33)
  Top 0.152: v55.1,51.9 55.4,51.6 56.5,51.6 57.75,50.35 X3.16
  Bottom 0.152: U8.9 55.02,51.83 v55.1,51.9
HDMI_TX_SDA_3V3  (via drill 0.33)
  Top 0.152: U2.P45 58.85,41.25 58.9,41.3 v58.9,43.7
  Bottom 0.152: U8.3 51.12,49.58 51.3,49.4 57.3,49.4 58.5,48.2 58.5,44.1 v58.9,43.7
LEDS0_CLK  (via drill 0.33)
  Top 0.152: U2.P81 39.75,33.45 v39.5,33.7
  Bottom 0.152: v39.5,33.7 39.4,33.8 39.4,36.6 40.4,37.6 40.4,45.4 36.35,49.45 U7.5
LEDS0_CLK_5V
  Bottom 0.152: U7.10 24.45,49.45 23.9,50 20.83,50 SV4.3 17.73,50.6 15.4,50.6 14.02,51.98 RN3.8
LEDS0_DATA  (via drill 0.33)
  Top 0.152: U2.P80 40.65,33.95 v40.1,34.5
  Bottom 0.152: v40.1,34.5 40,34.6 40,36.5 40.9,37.4 40.9,45.6 36.4,50.1 U7.4
LEDS0_DATA_5V
  Bottom 0.152: U7.11 24.7,50.1 24.2,50.6 22.77,50.6 SV4.2 20.8,51.9 19.5,53.2 15.1,53.2 14.85,52.95 RN3.7
LEDS1_CLK  (via drill 0.33)
  Top 0.152: U2.P79 41.55,34.45 v40.7,35.3
  Bottom 0.152: v40.7,35.3 40.6,35.4 40.6,36.4 41.4,37.2 41.4,45.8 36.45,50.75 U7.3
LEDS1_CLK_5V
  Bottom 0.152: U7.12 27.55,50.75 25.1,53.2 20.9,53.2 19.6,54.5 SV3.3 17.63,55.8 15.7,55.8 15,55.1 15,54 14.45,53.45 RN3.6
LEDS1_DATA  (via drill 0.33)
  Top 0.152: U2.P78 42.15,34.95 41.7,35.4 41.7,35.7 v41.3,36.1
  Bottom 0.152: v41.3,36.1 41.3,36.4 41.9,37 41.9,46 36.5,51.4 U7.2
LEDS1_DATA_5V
  Bottom 0.152: U7.13 28.5,51.4 27.9,52 27.9,52.9 25,55.8 22.77,55.8 SV3.2 19.57,56.4 15.4,56.4 14.02,55.02 RN3.5
N$1
  Top 0.152: U4.2 14.95,31.85 14.6,32.2 14.6,33.4 Y1.3 12.95,35.05 C23.1
N$2
  Top 0.152: 85.25,33.2 R23.2 85.3,33.25 X4.19
N$3  (via drill 0.33)
  Top 0.254: 30.5,35.6 L3.1
  Top 0.406: U12.3 28.77,42.88 | 28.77,42.88 C57.2 | 28.77,42.88 27.82,42.88 v27.8,42.9
  other vias: 29.3,35.6
  pour Bottom (isolate 0.254): 27.5,43 27.7,43.2 27.9,43.2 29.6,41.5 29.6,35.5 29.4,35.3 29.2,35.3 29,35.5 29,41.3 27.5,42.8
  pour Top (isolate 0.254, no thermals): 30.8,35.9 29.2,35.9 29,35.7 29,35.5 29.2,35.3 30.8,35.3
N$4
  Top 0.152: R26.1 R27.1 28.73,40.27 U12.7
N$5
  Top 0.152: U4.3 14.65,31.35 13.8,32.2 11.8,32.2 10.8,33.2 Y1.1 10.75,33.35 C18.1
N$6
  Top 0.152: U4.63 18.15,36.65 17.2,37.6 17.2,38.6 17.6,39 U3.5 R5.1
N$7
  Top 0.152: U4.7 4.28,29.35 X1.D-
N$8
  Top 0.152: U4.8 4.22,28.85 X1.D+
N$9
  Top 0.152: U4.62 18.65,37.85 18.44,38.06 U3.4 18.26,38.1 R6.1
N$10  (via drill 0.33)
  Top 0.152: U4.61 19.15,35.35 v19.4,35.6 | U3.3 15.74,38.1 v14.4,38.1 13.85,38.1 R8.2
  Bottom 0.152: v19.4,35.6 16.9,38.1 v14.4,38.1
N$11
  Top 0.152: U4.6 13.7,29.85 R9.2
N$12
  Top 0.152: R7.1 R8.1 13.49,39.94 U3.1
N$13
  Top 0.152: U4.14 13.8,25.85 R10.2
N$14
  Top 0.406: U12.2 29.77,43.52 29.45,43.85 C57.1
N$15
  Top 0.152: R29.1 R28.1 38.67,40.27 U12.10
N$16
  Top 0.406: U12.15 37.62,43.52 37.95,43.85 C59.1
N$20  (via drill 0.33)
  Top 0.254: v38,35.6 36.9,35.6 L4.1
  Top 0.406: U12.14 38.62,42.88 | 38.62,42.88 C59.2 | 38.62,42.88 39.48,42.88 v39.5,42.9
  pour Top (isolate 0.254, no thermals): 36.6,35.3 38.1,35.3 38.3,35.5 38.3,35.7 38.1,35.9 36.6,35.9
  pour Bottom (isolate 0.254): 39.8,43 39.6,43.2 39.4,43.2 39.2,43 39.2,38 37.7,36.5 37.7,35.5 37.9,35.3 38.1,35.3 38.3,35.5 38.3,36.3 39.8,37.8
N$28
  Top 0.254: FB1.2 C20.1 C21.1 11.75,30.55 12.4,31.2 14,31.2 14.35,30.85 U4.4
N$31
  Top 0.254: U4.9 14.95,28.35 14.6,28 9.95,28 C19.1 C17.1 FB2.2
N$34
  Top 0.152: R18.1 63.9,41.1 62.85,40.05 U2.P37
N$35
  Top 0.152: U2.P144 63.45,17.6 R13.1
N$39
  Top 0.152: U2.P39 61.85,41.6 R16.1
N$40
  Top 0.152: U9.5 41.49,41.91 45.9,37.5 48,37.5 49.35,38.85 U2.P64
N$41  (via drill 0.33)
  Top 0.152: v61.6,38.2 62.35,38.95 U2.P38 62.35,40.65 62.8,41.1 R21.1 | U9.1 v45.3,48.7
  Bottom 0.152: v45.3,48.7 45.3,45 48.2,42.1 49.1,42.1 51.4,39.8 60,39.8 v61.6,38.2
N$42
  Top 0.152: U2.P70 46.35,40.65 45.4,41.6 43.5,41.6 42.75,42.35 R20.1 R19.2 42.75,45.38 U9.6
N$43  (via drill 0.33)
  Top 0.152: 48.83,41.17 v48.8,41.2 48.85,41.15 U2.P65 | U9.2 44.03,49.16 v44.1,49.1
  Bottom 0.152: v48.8,41.2 48.4,41.2 44.7,44.9 44.7,48.5 v44.1,49.1
N$47
  Top 0.152: R4.1 39.65,55.7 LED1.A
N$49
  Top 0.406: JP2.2 29.6,11.72 X5.6 X5.12
N$50
  Top 0.152: X2.19 53.65,10.2 R15.2
N$51
  Top 0.406: JP3.2 6.74,11.72 X6.6 X6.12
PMOD0_0  (via drill 0.33)
  Top 0.152: U2.P104 41.95,21.95 41.8,21.8 v40.2,21.8
  Bottom 0.152: v40.2,21.8 32.8,21.8 27.8,16.8 21.2,16.8 19.49,15.09 X6.1
PMOD0_1  (via drill 0.33)
  Top 0.152: U2.P101 41.95,23.45 41.6,23.1 v40.2,23.1
  Bottom 0.152: v40.2,23.1 32.7,23.1 27.2,17.6 20.6,17.6 16.95,13.95 X6.2
PMOD0_2  (via drill 0.33)
  Top 0.152: U2.P99 41.75,24.45 41.7,24.5 v40.2,24.5
  Bottom 0.152: v40.2,24.5 32.7,24.5 26.6,18.4 20,18.4 14.41,12.81 X6.3
PMOD0_3  (via drill 0.33)
  Top 0.152: U2.P97 42.15,25.45 41.7,25.9 v40.2,25.9
  Bottom 0.152: v40.2,25.9 32.7,25.9 26,19.2 19.4,19.2 X6.4
PMOD1_0  (via drill 0.33)
  Top 0.152: U2.P105 42.15,21.45 41.8,21.1 v41.1,21.1
  Bottom 0.152: v41.1,21.1 32.8,21.1 28.1,16.4 21.5,16.4 20.8,15.7 20.8,10.44 X6.7
PMOD1_1  (via drill 0.33)
  Top 0.152: U2.P102 42.15,22.95 41.7,22.5 v41.1,22.5
  Bottom 0.152: v41.1,22.5 32.8,22.5 27.5,17.2 20.9,17.2 18.2,14.5 18.2,10.38 X6.8
PMOD1_2  (via drill 0.33)
  Top 0.152: U2.P100 41.75,23.95 41.6,23.8 v41.1,23.8
  Bottom 0.152: v41.1,23.8 32.7,23.8 26.9,18 20.3,18 15.7,13.4 15.7,10.42 X6.9
PMOD1_3  (via drill 0.33)
  Top 0.152: U2.P98 41.95,24.95 41.7,25.2 v41.1,25.2
  Bottom 0.152: v41.1,25.2 32.7,25.2 26.3,18.8 19.7,18.8 13.2,12.3 13.2,10.46 X6.10
PMOD2_0
  Top 0.152: U2.P118 49.85,15.95 46.4,12.5 43.1,12.5 42.35,11.75 X5.1
PMOD2_1
  Top 0.152: U2.P116 48.85,16.35 45.8,13.3 41.2,13.3 39.81,11.91 X5.2
PMOD2_2
  Top 0.152: U2.P114 47.85,16.75 45.2,14.1 39.7,14.1 X5.3
PMOD2_3
  Top 0.152: U2.P111 46.35,16.65 44.6,14.9 37.9,14.9 34.73,11.73 X5.4
PMOD3_0
  Top 0.152: X5.7 42.35,9.15 45.3,12.1 46.7,12.1 50.35,15.75 U2.P119
PMOD3_1
  Top 0.152: U2.P117 49.35,16.15 46.1,12.9 41.5,12.9 41.1,12.5 41.1,10.42 X5.8
PMOD3_2
  Top 0.152: U2.P115 48.35,16.55 45.5,13.7 40,13.7 38.6,12.3 38.6,10.46 X5.9
PMOD3_3
  Top 0.152: X5.10 36,10.4 36,12.2 38.3,14.5 44.9,14.5 46.85,16.45 U2.P112
USB_CTS#
  Top 0.152: U4.41 27.95,28.85 28.1,28.7 32.2,28.7 33.1,27.8 41.8,27.8 41.95,27.95 U2.P92
USB_DCD#
  Top 0.152: U4.45 27.95,30.85 28.2,31.1 36.1,31.1 36.7,31.7 41.2,31.7 41.95,32.45 U2.P83
USB_DSR#
  Top 0.152: U4.44 28.05,30.35 28.4,30.7 36.3,30.7 36.9,31.3 41.4,31.3 42.05,31.95 U2.P84
USB_DTR#
  Top 0.152: U4.43 28.15,29.85 28.6,30.3 36.5,30.3 37.1,30.9 41.6,30.9 42.15,31.45 U2.P85
USB_PWRSAVE#
  Top 0.152: U4.59 20.15,35.25 21.25,36.35 R12.2 R11.1
USB_RI#
  Top 0.152: U4.46 27.85,31.35 28,31.5 35.9,31.5 36.5,32.1 41,32.1 41.85,32.95 U2.P82
USB_RTS#
  Top 0.152: U4.40 27.85,28.35 27.9,28.3 32,28.3 32.9,27.4 42,27.4 42.05,27.45 U2.P93
USB_RXD
  Top 0.152: U4.39 27.85,27.85 27.9,27.9 31.8,27.9 32.7,27 42,27 42.05,26.95 U2.P94
USB_TCK  (via drill 0.33)  (1 unrouted)
  Top 0.152: U4.16 15.78,24.38 14.1,22.7 12.2,22.7 11.8,22.3 9.83,22.3 SV2.3 9.83,19.7 13.1,19.7 15.2,17.6 43.4,17.6 v44.2,16.8 45,17.6 U2.P109 | 69.83,19 U11.16 | 69.84,19 v68.3,19
  Bottom 0.152: v68.3,19 66.9,17.6 51.7,17.6 50.1,16 45,16 v44.2,16.8
USB_TDI
  Top 0.152: U2.P110 45.85,18.55 45.6,18.8 45.1,18.8 44.3,18 15.4,18 13.61,19.79 SV2.5 15.3,22.7 17.65,22.7 U4.17
USB_TMS  (via drill 0.33)
  Top 0.152: U4.19 18.65,22.05 17.6,21 SV2.6 16.15,19.25 16.6,18.8 41.6,18.8 41.9,19.1 41.9,20.2 42.15,20.45 U2.P107 46.45,20.45 49,23 v59.7,23 | v71.4,25.4 72.56,24.24 U11.13
  Bottom 0.152: v59.7,23 61.6,24.9 69.4,24.9 69.8,24.5 70.5,24.5 v71.4,25.4
USB_TXD
  Top 0.152: U4.38 27.95,27.35 28.1,27.5 31.6,27.5 32.5,26.6 41.8,26.6 41.95,26.45 U2.P95
USB_VBUS  (via drill 0.33)
  Top 0.152: R12.1 21.55,37.25 v21.5,37.3
  Top 0.406: X1.VBUS 5.1,30.1 5.6,30.6 v5.6,36.3
  Bottom 0.152: v21.5,37.3 21.5,43.66
  Bottom 0.406: JP1.3 21.5,43.66 12.96,43.66 v5.6,36.3
VREG5
  Top 0.254: C56.1 35.38,38.5 U12.9

## Text on the board
_tsilk: GND | CLK | DAT | 5V | OUT | 5V | ext. | USB | pandaLight | GND | rev.2 | IN2 | 3V3 | GND | TCK | TDO | TDI | TMS | 3V3 | 5V | 3V3 | 5V | PMOD | 0 | 2 | 1 | 3 | IN1